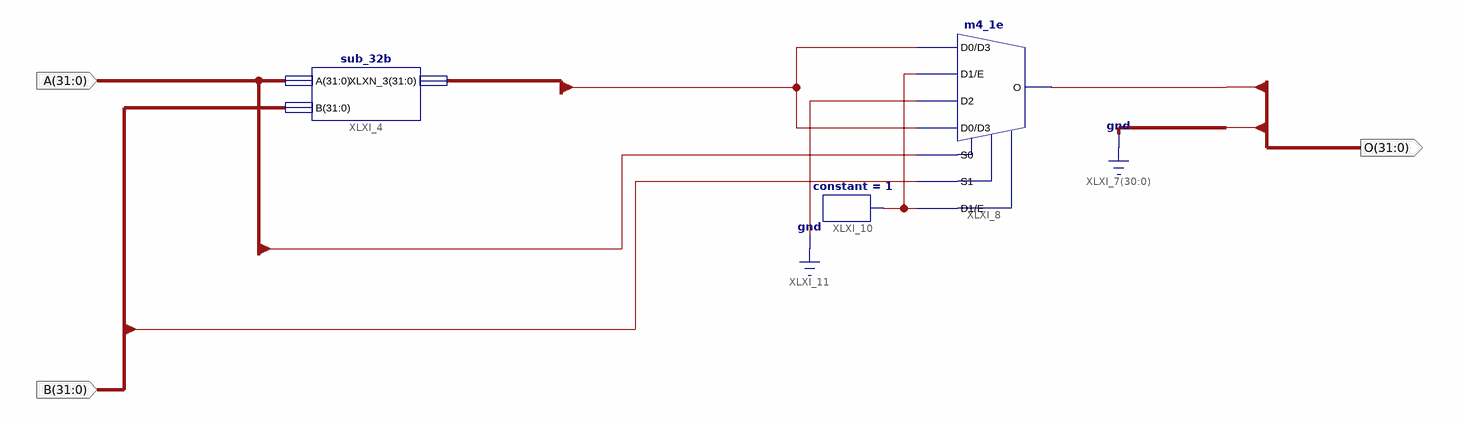
[diagram p0: schematic sheet 1]
// Xilinx ISE schematic slt_32b.sch (spartan3) as structural Verilog: 3 symbols, 3 ports
module slt_32b (
  input  [31:0] A,
  input  [31:0] B,
  output [31:0] O
);

  wire XLXN_31;
  wire [31:0] XLXN_7;

  sub_32b XLXI_4 (.A(A), .B(B), .XLXN_3(XLXN_7));
  m4_1e XLXI_8 (
    .D0(XLXN_7[31]), .D1(XLXN_31), .D2(1'b0), .D3(XLXN_7[31]), .E(XLXN_31), .S0(A[31]), .S1(B[31]), .O(O[0]));
  constant #(.CValue("1")) XLXI_10 (.O(XLXN_31));

  assign O[31:1] = {31{1'b0}};
endmodule
